# EAGLE schematic jack_led_matrix (EAGLE 9.6.0)
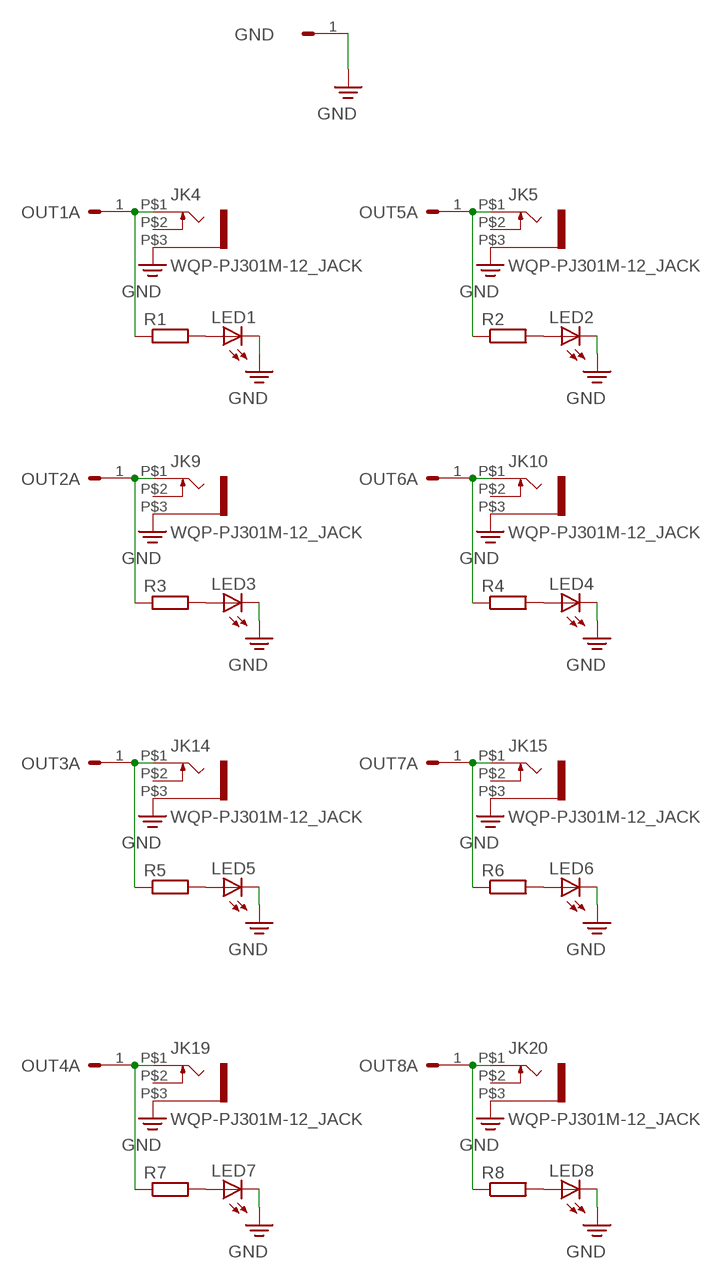
[diagram p0: schematic, sheet 1]

## Parts
GND  HEADER/MALE/01  [HEADER/MALE/01]
JK4  WQP-PJ301M-12_JACK  [WQP-PJ301M-12_JACK]
JK5  WQP-PJ301M-12_JACK  [WQP-PJ301M-12_JACK]
JK9  WQP-PJ301M-12_JACK  [WQP-PJ301M-12_JACK]
JK10  WQP-PJ301M-12_JACK  [WQP-PJ301M-12_JACK]
JK14  WQP-PJ301M-12_JACK  [WQP-PJ301M-12_JACK]
JK15  WQP-PJ301M-12_JACK  [WQP-PJ301M-12_JACK]
JK19  WQP-PJ301M-12_JACK  [WQP-PJ301M-12_JACK]
JK20  WQP-PJ301M-12_JACK  [WQP-PJ301M-12_JACK]
LED1  LED3MM  [LED3MM]
LED2  LED3MM  [LED3MM]
LED3  LED3MM  [LED3MM]
LED4  LED3MM  [LED3MM]
LED5  LED3MM  [LED3MM]
LED6  LED3MM  [LED3MM]
LED7  LED3MM  [LED3MM]
LED8  LED3MM  [LED3MM]
OUT1A  HEADER/MALE/01  [HEADER/MALE/01]
OUT2A  HEADER/MALE/01  [HEADER/MALE/01]
OUT3A  HEADER/MALE/01  [HEADER/MALE/01]
OUT4A  HEADER/MALE/01  [HEADER/MALE/01]
OUT5A  HEADER/MALE/01  [HEADER/MALE/01]
OUT6A  HEADER/MALE/01  [HEADER/MALE/01]
OUT7A  HEADER/MALE/01  [HEADER/MALE/01]
OUT8A  HEADER/MALE/01  [HEADER/MALE/01]
R1  RESISTORRESISTOR/UPRIGHT/7.5  [RESISTOR/7.5]
R2  RESISTORRESISTOR/UPRIGHT/7.5  [RESISTOR/7.5]
R3  RESISTORRESISTOR/UPRIGHT/7.5  [RESISTOR/7.5]
R4  RESISTORRESISTOR/UPRIGHT/7.5  [RESISTOR/7.5]
R5  RESISTORRESISTOR/UPRIGHT/7.5  [RESISTOR/7.5]
R6  RESISTORRESISTOR/UPRIGHT/7.5  [RESISTOR/7.5]
R7  RESISTORRESISTOR/UPRIGHT/7.5  [RESISTOR/7.5]
R8  RESISTORRESISTOR/UPRIGHT/7.5  [RESISTOR/7.5]

## Nets
N$1: JK4.P$1 OUT1A.1 R1.1
N$2: JK9.P$1 OUT2A.1 R3.1
N$3: JK14.P$1 OUT3A.1 R5.1
N$4: JK19.P$1 OUT4A.1 R7.1
N$5: JK5.P$1 OUT5A.1 R2.1
N$6: JK10.P$1 OUT6A.1 R4.1
N$7: JK15.P$1 OUT7A.1 R6.1
N$8: JK20.P$1 OUT8A.1 R8.1
N$40: LED1.A R1.2
N$41: LED2.A R2.2
N$42: LED3.A R3.2
N$43: LED4.A R4.2
N$44: LED5.A R5.2
N$45: LED6.A R6.2
N$46: LED7.A R7.2
N$47: LED8.A R8.2
PE: GND.1 JK4.P$3 JK5.P$3 JK9.P$3 JK10.P$3 JK14.P$3 JK15.P$3 JK19.P$3 JK20.P$3 LED1.K(C) LED2.K(C) LED3.K(C) LED4.K(C) LED5.K(C) LED6.K(C) LED7.K(C) LED8.K(C) ; supply symbol labelled GND
Unconnected: JK4.P$2 JK5.P$2 JK9.P$2 JK10.P$2 JK14.P$2 JK15.P$2 JK19.P$2 JK20.P$2

## Library data of the parts
GND OUT1A OUT2A OUT3A OUT4A OUT5A OUT6A OUT7A OUT8A = connectors:HEADER/MALE/01; SPICEPREFIX: X
JK4 JK5 JK9 JK10 JK14 JK15 JK19 JK20 = controls:WQP-PJ301M-12_JACK
LED1-LED8 = display_led:LED: LED OSRAM: - CHIPLED LG R971, LG N971, LY N971, LG Q971, LY Q971, LO R971, LY R971 LH N974, LH R974 LS Q976, LO Q976, LY Q976 LO Q996 - Hyper CHIPLED LW Q18S LB Q993, LB Q99A, LB R99A - SideLED LS A670, LO A670, LY A670, LG A670, LP A670 LB A673, LV A673, LT A673, LW A673 LH A674 LY A675 LS A676, LA A676, LO A676, LY A676, LW A676 LS A679, LY A679, LG A679 - Hyper Micro SIDELED® LS Y876, LA Y876, LO Y876, LY Y876 LT Y87S - SmartLED LW L88C, LW L88S LB L89C, LB L89S, LG L890 LS L89K, LO L89K, LY L89K LS L896, LA L896, LO L896, LY L896 - TOPLED LS T670, LO T670, LY T670, LG T670, LP T670 LSG T670, LSP T670, LSY T670, LOP T670, LYG T670 LG T671, LOG T671, LSG T671 LB T673, LV T673, LT T673, LW T673 LH T674 LS T676, LA T676, LO T676, LY T676, LB T676, LH T676, LSB T676, LW T676 LB T67C, LV T67C, LT T67C, LS T67K, LO T67K, LY T67K, LW E67C LS E67B, LA E67B, LO E67B, LY E67B, LB E67C, LV E67C, LT E67C LW T67C LS T679, LY T679, LG T679 LS T770, LO T770, LY T770, LG T770, LP T770 LB T773, LV T773, LT T773, LW T773 LH T774 LS E675, LA E675, LY E675, LS T675 LS T776, LA T776, LO T776, LY T776, LB T776 LHGB T686 LT T68C, LB T68C - Hyper Mini TOPLED® LB M676 - Mini TOPLED Santana® LG M470 LS M47K, LO M47K, LY M47K Source: http://www.osram.convergy.de LUXEON: - LUMILED® LXK2-PW12-R00, LXK2-PW12-S00, LXK2-PW14-U00, LXK2-PW14-V00 LXK2-PM12-R00, LXK2-PM12-S00, LXK2-PM14-U00 LXK2-PE12-Q00, LXK2-PE12-R00, LXK2-PE12-S00, LXK2-PE14-T00, LXK2-PE14-U00 LXK2-PB12-K00, LXK2-PB12-L00, LXK2-PB12-M00, LXK2-PB14-N00, LXK2-PB14-P00, LXK2-PB14-Q00 LXK2-PR12-L00, LXK2-PR12-M00, LXK2-PR14-Q00, LXK2-PR14-R00 LXK2-PD12-Q00, LXK2-PD12-R00, LXK2-PD12-S00 LXK2-PH12-R00, LXK2-PH12-S00 LXK2-PL12-P00, LXK2-PL12-Q00, LXK2-PL12-R00 Source: www.luxeon.com KINGBRIGHT: KA-3528ASYC Source: www.kingbright.com
R1-R8 = resistors:RESISTOR: RESISTOR, European symbol